# EAGLE schematic atari_superxe_motherboard (EAGLE 7.2.0)

## Sheet 1 of 12: FPGACore
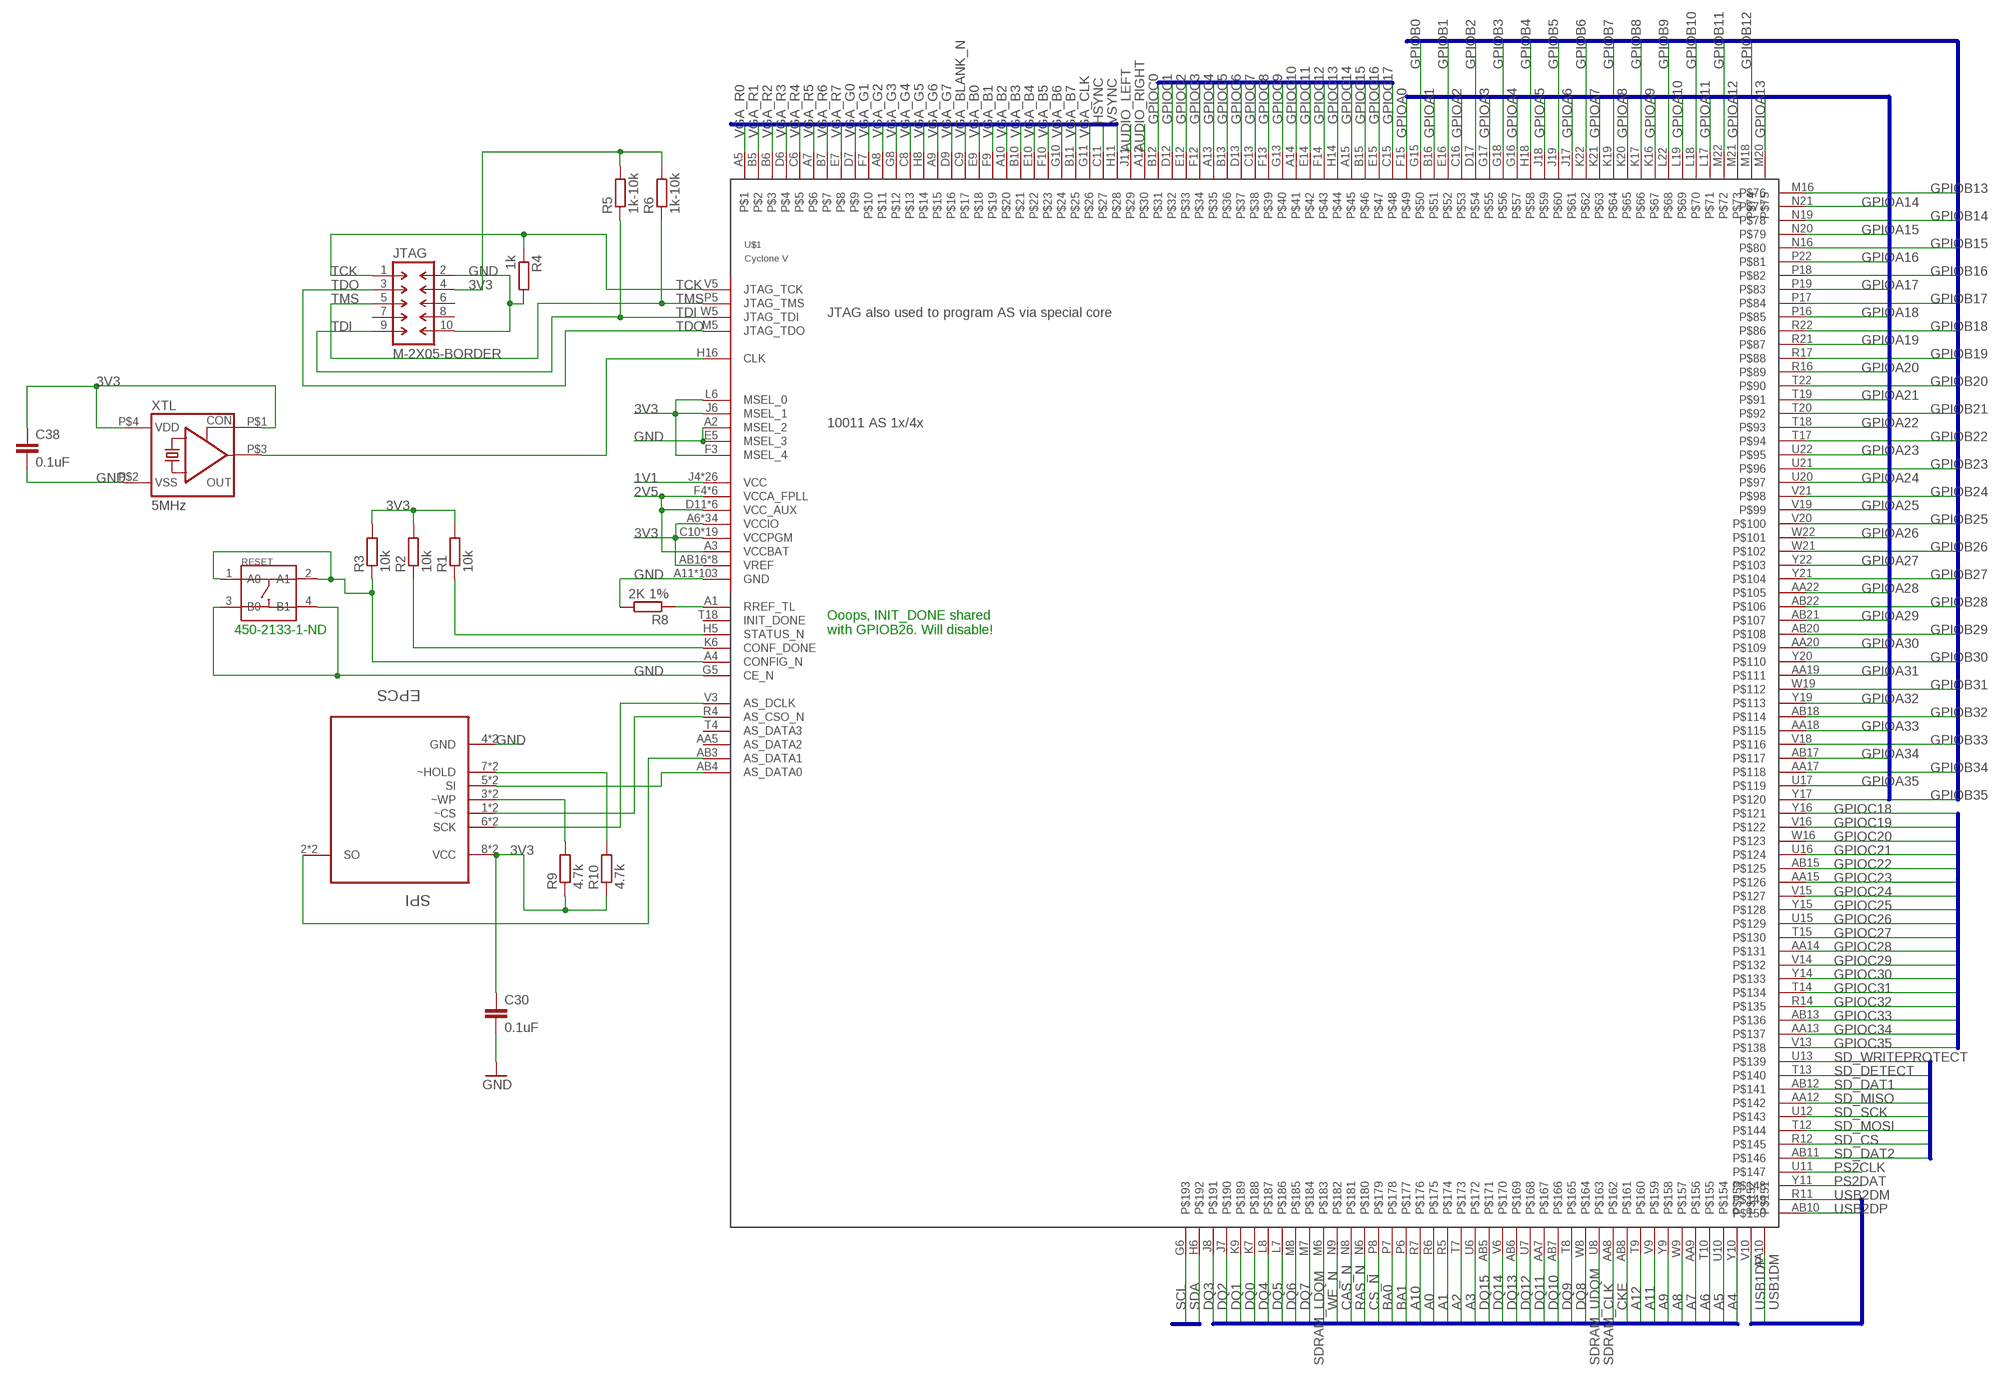
[diagram p0: schematic, sheet 1]

### Parts
C30  0.1uF  C-EUC0805  [C0805]
C38  0.1uF  C-EUC0805  [C0805]
JTAG  M-2X05-BORDER  [DIL-100-2X05-BRD]
R1  10k  R-EU_M0805  [M0805]
R2  10k  R-EU_M0805  [M0805]
R3  10k  R-EU_M0805  [M0805]
R4  1k  R-EU_M0805  [M0805]
R5  1k-10k  R-EU_M0805  [M0805]
R6  1k-10k  R-EU_M0805  [M0805]
R8  2K 1%  R-EU_M0805  [M0805]
R9  4.7k  R-EU_M0805  [M0805]
R10  4.7k  R-EU_M0805  [M0805]
RESET  SMD-BUTTON(4P-4.0X4.0X1.7MM)-DHT-1152  [SW4-SMD-4.0X4.0X1.7MM]
SPI  EPCS  EPCSBOTH  [EPCS_BOTH]
U$1  CYCLONEVFPGA484SMALLPINS  [CYCLONEVF484V2]
XTL  5MHz  CRYSTAL_RES-SG636  [SG-636]

### Nets
1V1: U$1.J4(VCC) U$1.J10(VCC) U$1.J12(VCC) U$1.J14(VCC) U$1.J16(VCC) U$1.K3(VCC) U$1.K5(VCC) U$1.K11(VCC) U$1.K13(VCC) U$1.K15(VCC) U$1.L4(VCC) U$1.L10(VCC) U$1.L12(VCC) U$1.L14(VCC) U$1.L16(VCC) U$1.M11(VCC) U$1.M13(VCC) U$1.M15(VCC) U$1.N4(VCC) U$1.N10(VCC) U$1.N12(VCC) U$1.N14(VCC) U$1.P3(VCC) U$1.P11(VCC) U$1.P13(VCC) U$1.P15(VCC) ; also sheet 2,9
2V5: U$1.A3(VCCBAT) U$1.D11(VCC_AUX) U$1.D18(VCC_AUX) U$1.E6(VCC_AUX) U$1.F4(VCCA_FPLL) U$1.H19(VCCA_FPLL) U$1.M3(VCCA_FPLL) U$1.T3(VCCA_FPLL) U$1.T5(VCCA_FPLL) U$1.U18(VCCA_FPLL) U$1.W7(VCC_AUX) U$1.W13(VCC_AUX) U$1.W18(VCC_AUX) ; also sheet 2,9
3V3: C30.1 C38.1 JTAG.4 R1.2 R2.2 R3.2 R5.2 R6.2 R9.1 R10.1 SPI.8(VCC) SPI.L$2(VCC) U$1.A6(VCCIO) U$1.A16(VCCIO) U$1.AA16(VCCIO) U$1.AA21(VCCIO) U$1.AB16(VREF) U$1.B8(VREF) U$1.B19(VCCIO) U$1.C7(VCCIO) U$1.C10(VCCPGM) U$1.C12(VCCIO) U$1.C14(VREF) U$1.C22(VCCIO) U$1.D4(VCCIO) U$1.D8(VCCPGM) U$1.D14(VCCPGM) U$1.D15(VCCIO) U$1.D16(VCCPGM) U$1.E1(VCCPGM) U$1.E8(VCCIO) U$1.E11(VCCPGM) U$1.E18(VCCIO) U$1.F3(MSEL_4) U$1.F8(VCCPGM) U$1.F11(VCCIO) U$1.F21(VCCIO) U$1.G7(VCCIO) U$1.G14(VCCIO) U$1.H17(VCCIO) U$1.J1(VCCIO) U$1.J2(VCCPGM) U$1.J6(MSEL_1) U$1.K18(VCCIO) U$1.L6(MSEL_0) U$1.L20(VREF) U$1.M17(VCCPGM) U$1.M19(VCCIO) U$1.N18(VCCPGM) U$1.P20(VCCIO) U$1.P21(VCCPGM) U$1.R1(VCCIO) U$1.R2(VCCPGM) U$1.R8(VCCIO) U$1.R18(VCCIO) U$1.R19(VCCPGM) U$1.R20(VREF) U$1.T6(VCCIO) U$1.T11(VCCIO) U$1.U14(VCCIO) U$1.U19(VCCIO) U$1.V8(VCCPGM) U$1.W1(VREF) U$1.W6(VCCPGM) U$1.W10(VCCIO) U$1.W11(VCCPGM) U$1.W12(VCCPGM) U$1.W14(VCCPGM) U$1.W15(VCCIO) U$1.W17(VCCPGM) U$1.W20(VCCIO) U$1.Y4(VCCIO) U$1.Y7(VREF) U$1.Y8(VCCIO) U$1.Y12(VREF) U$1.Y13(VCCIO) XTL.P$1(CON) XTL.P$4(VDD) ; also sheet 2,3,5,6,8,9,10,11
A0: U$1.R6 ; also sheet 6
A1: U$1.R5 ; also sheet 6
A2: U$1.T7 ; also sheet 6
A3: U$1.U6 ; also sheet 6
A4: U$1.Y10 ; also sheet 6
A5: U$1.U10 ; also sheet 6
A6: U$1.T10 ; also sheet 6
A7: U$1.AA9 ; also sheet 6
A8: U$1.W9 ; also sheet 6
A9: U$1.Y9 ; also sheet 6
A10: U$1.R7 ; also sheet 6
A11: U$1.V9 ; also sheet 6
A12: U$1.T9 ; also sheet 6
AUDIO_LEFT: U$1.J11 ; also sheet 4
AUDIO_RIGHT: U$1.A12 ; also sheet 4
BA0: U$1.P7 ; also sheet 6
BA1: U$1.P6 ; also sheet 6
CAS_N: U$1.N8 ; also sheet 6
CKE: U$1.AB8 ; also sheet 6
CONF_DONE: R2.1 U$1.K6(CONF_DONE)
CONFIG_N: R3.1 RESET.1(A0) RESET.2(A1) U$1.A4(CONFIG_N)
CS_N: U$1.P8 ; also sheet 6
DQ0: U$1.K7 ; also sheet 6
DQ1: U$1.K9 ; also sheet 6
DQ2: U$1.J7 ; also sheet 6
DQ3: U$1.J8 ; also sheet 6
DQ4: U$1.L8 ; also sheet 6
DQ5: U$1.L7 ; also sheet 6
DQ6: U$1.M8 ; also sheet 6
DQ7: U$1.M7 ; also sheet 6
DQ8: U$1.W8 ; also sheet 6
DQ9: U$1.T8 ; also sheet 6
DQ10: U$1.AB7 ; also sheet 6
DQ11: U$1.AA7 ; also sheet 6
DQ12: U$1.U7 ; also sheet 6
DQ13: U$1.AB6 ; also sheet 6
DQ14: U$1.V6 ; also sheet 6
DQ15: U$1.AB5 ; also sheet 6
GND: C30.2 C38.2 JTAG.2 JTAG.10 R4.2 R8.2 RESET.3(B0) RESET.4(B1) SPI.4(GND) SPI.L$10(GND) U$1.A2(MSEL_2) U$1.A11(GND) U$1.A21(GND) U$1.AA3(GND) U$1.AA4(GND) U$1.AA6(GND) U$1.AA11(GND) U$1.AB1(GND) U$1.AB2(GND) U$1.AB9(GND) U$1.AB14(GND) U$1.AB19(GND) U$1.B1(GND) U$1.B2(GND) U$1.B9(GND) U$1.B14(GND) U$1.C3(GND) U$1.C4(GND) U$1.C5(GND) U$1.C17(GND) U$1.D1(GND) U$1.D2(GND) U$1.D5(GND) U$1.D10(GND) U$1.D20(GND) U$1.E3(GND) U$1.E4(GND) U$1.E5(MSEL_3) U$1.E13(GND) U$1.F1(GND) U$1.F2(GND) U$1.F5(GND) U$1.F6(GND) U$1.F16(GND) U$1.F17(GND) U$1.G3(GND) U$1.G4(GND) U$1.G5(CE_N) U$1.G9(GND) U$1.G19(GND) U$1.H1(GND) U$1.H2(GND) U$1.H3(GND) U$1.H4(GND) U$1.H7(GND) U$1.H12(GND) U$1.H15(GND) U$1.H22(GND) U$1.J3(GND) U$1.J5(GND) U$1.J15(GND) U$1.J20(GND) U$1.K1(GND) U$1.K2(GND) U$1.K4(GND) U$1.K8(GND) U$1.K10(GND) U$1.K12(GND) U$1.K14(GND) U$1.L3(GND) U$1.L5(GND) U$1.L11(GND) U$1.L13(GND) U$1.L15(GND) U$1.L21(GND) U$1.M1(GND) U$1.M2(GND) U$1.M4(GND) U$1.M10(GND) U$1.M12(GND) U$1.M14(GND) U$1.N3(GND) U$1.N5(GND) U$1.N7(GND) U$1.N11(GND) U$1.N13(GND) U$1.N15(GND) U$1.N17(GND) U$1.N22(GND) U$1.P1(GND) U$1.P2(GND) U$1.P4(GND) U$1.P10(GND) U$1.R3(GND) U$1.R13(GND) U$1.T1(GND) U$1.T2(GND) U$1.T16(GND) U$1.T21(GND) U$1.U3(GND) U$1.U4(GND) U$1.U5(GND) U$1.U9(GND) U$1.V1(GND) U$1.V2(GND) U$1.V4(GND) U$1.V7(GND) U$1.V12(GND) U$1.V17(GND) U$1.V22(GND) U$1.W3(GND) U$1.W4(GND) U$1.Y1(GND) U$1.Y2(GND) U$1.Y5(GND) U$1.Y18(GND) XTL.P$2(VSS) ; also sheet 2,3,4,5,6,7,8,9,10,11,12
GPIOA0: U$1.F15 ; also sheet 5
GPIOA1: U$1.B16 ; also sheet 5
GPIOA2: U$1.C16 ; also sheet 5
GPIOA3: U$1.G17 ; also sheet 5
GPIOA4: U$1.G16 ; also sheet 5
GPIOA5: U$1.J18 ; also sheet 5
GPIOA6: U$1.J17 ; also sheet 5
GPIOA7: U$1.K21 ; also sheet 5
GPIOA8: U$1.K20 ; also sheet 5
GPIOA9: U$1.K16 ; also sheet 5
GPIOA10: U$1.L19 ; also sheet 5
GPIOA11: U$1.L17 ; also sheet 5
GPIOA12: U$1.M21 ; also sheet 5
GPIOA13: U$1.M20 ; also sheet 5
GPIOA14: U$1.N21 ; also sheet 5
GPIOA15: U$1.N20 ; also sheet 5
GPIOA16: U$1.P22 ; also sheet 5
GPIOA17: U$1.P19 ; also sheet 5
GPIOA18: U$1.P16 ; also sheet 5
GPIOA19: U$1.R21 ; also sheet 5
GPIOA20: U$1.R16 ; also sheet 5
GPIOA21: U$1.T19 ; also sheet 5
GPIOA22: U$1.T18 ; also sheet 5
GPIOA23: U$1.U22 ; also sheet 5
GPIOA24: U$1.U20 ; also sheet 5
GPIOA25: U$1.V19 ; also sheet 5
GPIOA26: U$1.W22 ; also sheet 5
GPIOA27: U$1.Y22 ; also sheet 5
GPIOA28: U$1.AA22 ; also sheet 5
GPIOA29: U$1.AB21 ; also sheet 5
GPIOA30: U$1.AA20 ; also sheet 5
GPIOA31: U$1.AA19 ; also sheet 5
GPIOA32: U$1.Y19 ; also sheet 5
GPIOA33: U$1.AA18 ; also sheet 5
GPIOA34: U$1.AB17 ; also sheet 5
GPIOA35: U$1.U17 ; also sheet 5
GPIOB0: U$1.G15 ; also sheet 5
GPIOB1: U$1.E16 ; also sheet 5
GPIOB2: U$1.D17 ; also sheet 5
GPIOB3: U$1.G18 ; also sheet 5
GPIOB4: U$1.H18 ; also sheet 5
GPIOB5: U$1.J19 ; also sheet 5
GPIOB6: U$1.K22 ; also sheet 5
GPIOB7: U$1.K19 ; also sheet 5
GPIOB8: U$1.K17 ; also sheet 5
GPIOB9: U$1.L22 ; also sheet 5
GPIOB10: U$1.L18 ; also sheet 5
GPIOB11: U$1.M22 ; also sheet 5
GPIOB12: U$1.M18 ; also sheet 5
GPIOB13: U$1.M16 ; also sheet 5
GPIOB14: U$1.N19 ; also sheet 5
GPIOB15: U$1.N16 ; also sheet 5
GPIOB16: U$1.P18 ; also sheet 5
GPIOB17: U$1.P17 ; also sheet 5
GPIOB18: U$1.R22 ; also sheet 5
GPIOB19: U$1.R17 ; also sheet 5
GPIOB20: U$1.T22 ; also sheet 5
GPIOB21: U$1.T20 ; also sheet 5
GPIOB22: U$1.T17 ; also sheet 5
GPIOB23: U$1.U21 ; also sheet 5
GPIOB24: U$1.V21 ; also sheet 5
GPIOB25: U$1.V20 ; also sheet 5
GPIOB26: U$1.W21 ; also sheet 5
GPIOB27: U$1.Y21 ; also sheet 5
GPIOB28: U$1.AB22 ; also sheet 5
GPIOB29: U$1.AB20 ; also sheet 5
GPIOB30: U$1.Y20 ; also sheet 5
GPIOB31: U$1.W19 ; also sheet 5
GPIOB32: U$1.AB18 ; also sheet 5
GPIOB33: U$1.V18 ; also sheet 5
GPIOB34: U$1.AA17 ; also sheet 5
GPIOB35: U$1.Y17 ; also sheet 5
GPIOC0: U$1.B12 ; also sheet 5
GPIOC1: U$1.D12 ; also sheet 5
GPIOC2: U$1.E12 ; also sheet 5
GPIOC3: U$1.F12 ; also sheet 5
GPIOC4: U$1.A13 ; also sheet 5
GPIOC5: U$1.B13 ; also sheet 5
GPIOC6: U$1.D13 ; also sheet 5
GPIOC7: U$1.C13 ; also sheet 5
GPIOC8: U$1.F13 ; also sheet 5
GPIOC9: U$1.G13 ; also sheet 5
GPIOC10: U$1.A14 ; also sheet 5
GPIOC11: U$1.E14 ; also sheet 5
GPIOC12: U$1.F14 ; also sheet 5
GPIOC13: U$1.H14 ; also sheet 5
GPIOC14: U$1.A15 ; also sheet 5
GPIOC15: U$1.B15 ; also sheet 5
GPIOC16: U$1.E15 ; also sheet 5
GPIOC17: U$1.C15 ; also sheet 5
GPIOC18: U$1.Y16 ; also sheet 5
GPIOC19: U$1.V16 ; also sheet 5
GPIOC20: U$1.W16 ; also sheet 5
GPIOC21: U$1.U16 ; also sheet 5
GPIOC22: U$1.AB15 ; also sheet 5
GPIOC23: U$1.AA15 ; also sheet 5
GPIOC24: U$1.V15 ; also sheet 5
GPIOC25: U$1.Y15 ; also sheet 5
GPIOC26: U$1.U15 ; also sheet 5
GPIOC27: U$1.T15 ; also sheet 5
GPIOC28: U$1.AA14 ; also sheet 5
GPIOC29: U$1.V14 ; also sheet 5
GPIOC30: U$1.Y14 ; also sheet 5
GPIOC31: U$1.T14 ; also sheet 5
GPIOC32: U$1.R14 ; also sheet 5
GPIOC33: U$1.AB13 ; also sheet 5
GPIOC34: U$1.AA13 ; also sheet 5
GPIOC35: U$1.V13 ; also sheet 5
HSYNC: U$1.C11 ; also sheet 3
N$6: SPI.6(SCK) SPI.L$16(SCK) U$1.V3(AS_DCLK)
N$7: SPI.1(~CS) SPI.L$7(~CS) U$1.R4(AS_CSO_N)
N$8: SPI.2(SO) SPI.L$8(SO) U$1.AB3(AS_DATA1)
N$9: SPI.5(SI) SPI.L$15(SI) U$1.AB4(AS_DATA0)
N$10: R9.2 SPI.3(~WP) SPI.L$9(~WP)
N$11: R10.2 SPI.7(~HOLD) SPI.L$1(~HOLD)
N$12: U$1.H16(CLK) XTL.P$3(OUT)
PS2CLK: U$1.U11 ; also sheet 7
PS2DAT: U$1.Y11 ; also sheet 7
RAS_N: U$1.N6 ; also sheet 6
RREF_TL: R8.1 U$1.A1(RREF_TL)
SCL: U$1.G6 ; also sheet 11
SD_CS: U$1.R12 ; also sheet 10
SD_DAT1: U$1.AB12 ; also sheet 10
SD_DAT2: U$1.AB11 ; also sheet 10
SD_DETECT: U$1.T13 ; also sheet 10
SD_MISO: U$1.AA12 ; also sheet 10
SD_MOSI: U$1.T12 ; also sheet 10
SD_SCK: U$1.U12 ; also sheet 10
SD_WRITEPROTECT: U$1.U13 ; also sheet 10
SDA: U$1.H6 ; also sheet 11
SDRAM_CLK: U$1.AA8 ; also sheet 6
SDRAM_LDQM: U$1.M6 ; also sheet 6
SDRAM_UDQM: U$1.U8 ; also sheet 6
STATUS_N: R1.1 U$1.H5(STATUS_N)
TCK: JTAG.1 R4.1 U$1.V5(JTAG_TCK)
TDI: JTAG.9 R5.1 U$1.W5(JTAG_TDI)
TDO: JTAG.3 U$1.M5(JTAG_TDO)
TMS: JTAG.5 R6.1 U$1.P5(JTAG_TMS)
USB1DM: U$1.AA10 ; also sheet 7
USB1DP: U$1.V10 ; also sheet 7
USB2DM: U$1.R11 ; also sheet 7
USB2DP: U$1.AB10 ; also sheet 7
VGA_B0: U$1.E9 ; also sheet 3
VGA_B1: U$1.F9 ; also sheet 3
VGA_B2: U$1.A10 ; also sheet 3
VGA_B3: U$1.B10 ; also sheet 3
VGA_B4: U$1.E10 ; also sheet 3
VGA_B5: U$1.F10 ; also sheet 3
VGA_B6: U$1.G10 ; also sheet 3
VGA_B7: U$1.B11 ; also sheet 3
VGA_BLANK_N: U$1.C9 ; also sheet 3
VGA_CLK: U$1.G11 ; also sheet 3
VGA_G0: U$1.D7 ; also sheet 3
VGA_G1: U$1.F7 ; also sheet 3
VGA_G2: U$1.A8 ; also sheet 3
VGA_G3: U$1.G8 ; also sheet 3
VGA_G4: U$1.C8 ; also sheet 3
VGA_G5: U$1.H8 ; also sheet 3
VGA_G6: U$1.A9 ; also sheet 3
VGA_G7: U$1.D9 ; also sheet 3
VGA_R0: U$1.A5 ; also sheet 3
VGA_R1: U$1.B5 ; also sheet 3
VGA_R2: U$1.B6 ; also sheet 3
VGA_R3: U$1.D6 ; also sheet 3
VGA_R4: U$1.C6 ; also sheet 3
VGA_R5: U$1.A7 ; also sheet 3
VGA_R6: U$1.B7 ; also sheet 3
VGA_R7: U$1.E7 ; also sheet 3
VSYNC: U$1.H11 ; also sheet 3
WE_N: U$1.N9 ; also sheet 6
Unconnected: JTAG.6 JTAG.7 JTAG.8 U$1.AA5(AS_DATA2) U$1.T4(AS_DATA3) U$1.T18(INIT_DONE)

### Buses
SDRAM:A[0..12],DQ[0..15],CS_N,RAS_N,CAS_N,WE_N,SDRAM_CLK,CKE,SDRAM_UDQM,SDRAM_LDQM,BA[0..1]
USB1DP,USB1DM,USB2DP,USB2DM
VGADAC:VGA_R[0..7],VGA_G[0..7],VGA_B[0..7],VGA_CLK,VGA_BLANK_N,HSYNC,VSYNC
SD_DETECT,SD_WRITEPROTECT,SD_CS,SD_MISO,SD_MOSI,SD_SCK,SD_DAT1,SD_DAT2
GPIOC[0..35]
GPIOA[0..35]
GPIOB[0..35]
ADC:SCL,SDA

### Notes on the sheet
- JTAG also used to program AS via special core
- 10011 AS 1x/4x
- 450-2133-1-ND
- Ooops, INIT_DONE shared
  with GPIOB26. Will disable!

## Sheet 2 of 12: FPGA decoupling
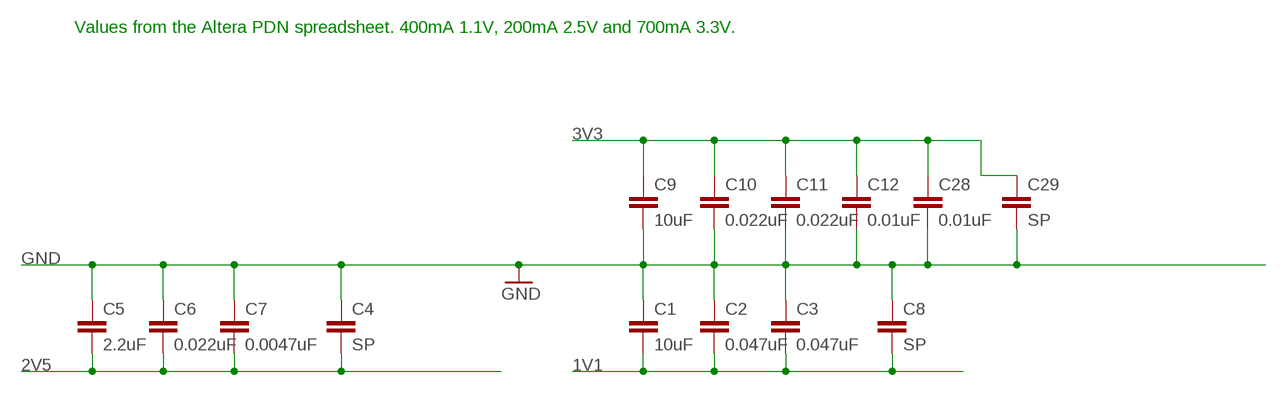
[diagram p1: schematic, sheet 2]

### Parts
C1  10uF  C-EUC0805  [C0805]
C2  0.047uF  C-EUC0805  [C0805]
C3  0.047uF  C-EUC0805  [C0805]
C4  SP  C-EUC0805  [C0805]
C5  2.2uF  C-EUC0805  [C0805]
C6  0.022uF  C-EUC0805  [C0805]
C7  0.0047uF  C-EUC0805  [C0805]
C8  SP  C-EUC0805  [C0805]
C9  10uF  C-EUC0805  [C0805]
C10  0.022uF  C-EUC0805  [C0805]
C11  0.022uF  C-EUC0805  [C0805]
C12  0.01uF  C-EUC0805  [C0805]
C28  0.01uF  C-EUC0805  [C0805]
C29  SP  C-EUC0805  [C0805]

### Nets
1V1: C1.2 C2.2 C3.2 C8.2 ; also sheet 1,9
2V5: C4.2 C5.2 C6.2 C7.2 ; also sheet 1,9
3V3: C9.1 C10.1 C11.1 C12.1 C28.1 C29.1 ; also sheet 1,3,5,6,8,9,10,11
GND: C1.1 C2.1 C3.1 C4.1 C5.1 C6.1 C7.1 C8.1 C9.2 C10.2 C11.2 C12.2 C28.2 C29.2 ; also sheet 1,3,4,5,6,7,8,9,10,11,12

### Notes on the sheet
- Values from the Altera PDN spreadsheet. 400mA 1.1V, 200mA 2.5V and 700mA 3.3V.

## Sheet 3 of 12: Video
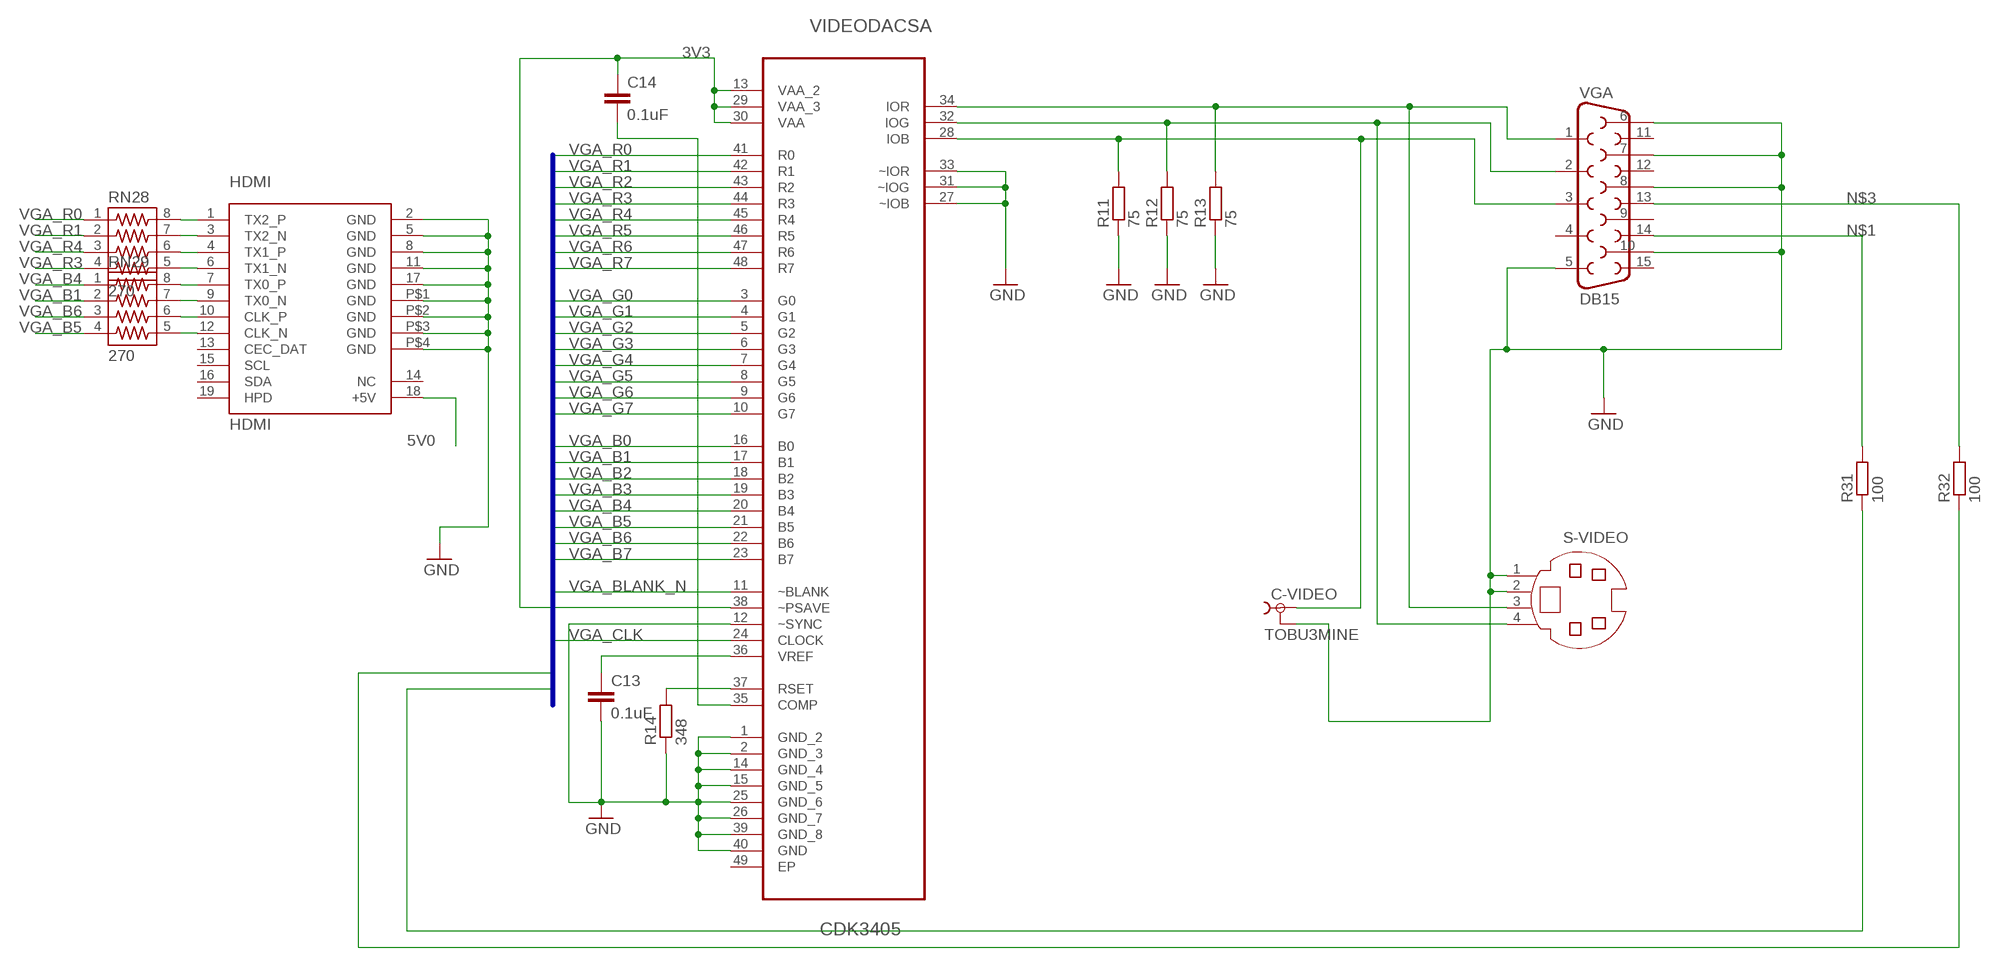
[diagram p2: schematic, sheet 3]

### Parts
C13  0.1uF  C-EUC0805  [C0805]
C14  0.1uF  C-EUC0805  [C0805]
C-VIDEO  TOBU3MINE  [TOBU3_EXT]
HDMI  HDMI  [HDMI]
R11  75  R-EU_M0805  [M0805]
R12  75  R-EU_M0805  [M0805]
R13  75  R-EU_M0805  [M0805]
R14  348  R-EU_M0805  [M0805]
R31  100  R-EU_R0805  [R0805]
R32  100  R-EU_R0805  [R0805]
RN28  270  742-8742_3  [743-8]
RN29  270  742-8742_3  [743-8]
S-VIDEO  MD04SS  [MDIN04SS]
VGA  DB15  [DB15]
VIDEODACSA  CDK3405  ADV7125BCPZ170TQFP-48  [QFP50P900X900X120-49N]

### Nets
3V3: C14.1 VIDEODACSA.13(VAA_2) VIDEODACSA.29(VAA_3) VIDEODACSA.30(VAA) VIDEODACSA.38(~PSAVE) ; also sheet 1,2,5,6,8,9,10,11
5V0: HDMI.18(+5V) ; also sheet 5,7,9,11
GND: C13.2 C-VIDEO.2 C-VIDEO.2@1 C-VIDEO.2@2 HDMI.2(GND) HDMI.5(GND) HDMI.8(GND) HDMI.11(GND) HDMI.17(GND) HDMI.P$1(GND) HDMI.P$2(GND) HDMI.P$3(GND) HDMI.P$4(GND) R11.1 R12.1 R13.1 R14.1 S-VIDEO.1 S-VIDEO.2 VGA.5 VGA.6 VGA.7 VGA.8 VGA.10 VIDEODACSA.1(GND_2) VIDEODACSA.2(GND_3) VIDEODACSA.12(~SYNC) VIDEODACSA.14(GND_4) VIDEODACSA.15(GND_5) VIDEODACSA.25(GND_6) VIDEODACSA.26(GND_7) VIDEODACSA.27(~IOB) VIDEODACSA.31(~IOG) VIDEODACSA.33(~IOR) VIDEODACSA.39(GND_8) VIDEODACSA.40(GND) ; also sheet 1,2,4,5,6,7,8,9,10,11,12
HSYNC: R32.1 ; also sheet 1
N$1: R31.2 VGA.14
N$3: R32.2 VGA.13
N$13: R13.2 S-VIDEO.3 VGA.1 VIDEODACSA.34(IOR)
N$14: R12.2 S-VIDEO.4 VGA.2 VIDEODACSA.32(IOG)
N$16: C13.1 VIDEODACSA.36(VREF)
N$17: R14.2 VIDEODACSA.37(RSET)
N$18: C14.2 VIDEODACSA.35(COMP)
N$134: HDMI.1(TX2_P) RN28.8
N$143: C-VIDEO.1 R11.2 VGA.3 VIDEODACSA.28(IOB)
N$144: HDMI.3(TX2_N) RN28.7
N$146: HDMI.4(TX1_P) RN28.6
N$147: HDMI.6(TX1_N) RN28.5
N$148: HDMI.7(TX0_P) RN29.8
N$149: HDMI.9(TX0_N) RN29.7
N$150: HDMI.10(CLK_P) RN29.6
N$151: HDMI.12(CLK_N) RN29.5
VGA_B0: VIDEODACSA.16(B0) ; also sheet 1
VGA_B1: RN29.2 VIDEODACSA.17(B1) ; also sheet 1
VGA_B2: VIDEODACSA.18(B2) ; also sheet 1
VGA_B3: VIDEODACSA.19(B3) ; also sheet 1
VGA_B4: RN29.1 VIDEODACSA.20(B4) ; also sheet 1
VGA_B5: RN29.4 VIDEODACSA.21(B5) ; also sheet 1
VGA_B6: RN29.3 VIDEODACSA.22(B6) ; also sheet 1
VGA_B7: VIDEODACSA.23(B7) ; also sheet 1
VGA_BLANK_N: VIDEODACSA.11(~BLANK) ; also sheet 1
VGA_CLK: VIDEODACSA.24(CLOCK) ; also sheet 1
VGA_G0: VIDEODACSA.3(G0) ; also sheet 1
VGA_G1: VIDEODACSA.4(G1) ; also sheet 1
VGA_G2: VIDEODACSA.5(G2) ; also sheet 1
VGA_G3: VIDEODACSA.6(G3) ; also sheet 1
VGA_G4: VIDEODACSA.7(G4) ; also sheet 1
VGA_G5: VIDEODACSA.8(G5) ; also sheet 1
VGA_G6: VIDEODACSA.9(G6) ; also sheet 1
VGA_G7: VIDEODACSA.10(G7) ; also sheet 1
VGA_R0: RN28.1 VIDEODACSA.41(R0) ; also sheet 1
VGA_R1: RN28.2 VIDEODACSA.42(R1) ; also sheet 1
VGA_R2: VIDEODACSA.43(R2) ; also sheet 1
VGA_R3: RN28.4 VIDEODACSA.44(R3) ; also sheet 1
VGA_R4: RN28.3 VIDEODACSA.45(R4) ; also sheet 1
VGA_R5: VIDEODACSA.46(R5) ; also sheet 1
VGA_R6: VIDEODACSA.47(R6) ; also sheet 1
VGA_R7: VIDEODACSA.48(R7) ; also sheet 1
VSYNC: R31.1 ; also sheet 1
Unconnected: HDMI.13(CEC_DAT) HDMI.14(NC) HDMI.15(SCL) HDMI.16(SDA) HDMI.19(HPD) VGA.4 VGA.9 VGA.11 VGA.12 VGA.15 VIDEODACSA.49(EP)

### Buses
VGADAC:VGA_R[0..7],VGA_G[0..7],VGA_B[0..7],VGA_CLK,VGA_BLANK_N,HSYNC,VSYNC

## Sheet 4 of 12: Audio
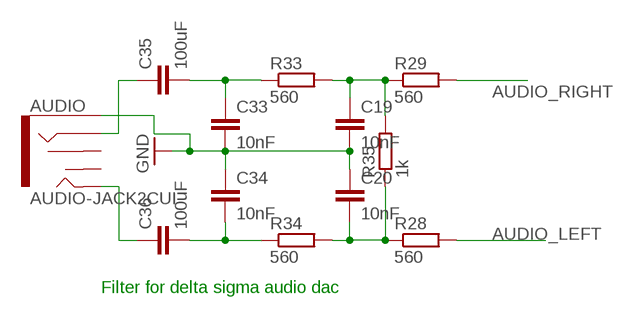
[diagram p3: schematic, sheet 4]

### Parts
AUDIO  AUDIO-JACK2CUI  [AUDIO-JACK-CUI-353X]
C19  10nF  C-EUC0805  [C0805]
C20  10nF  C-EUC0805  [C0805]
C33  10nF  C-EUC0805  [C0805]
C34  10nF  C-EUC0805  [C0805]
C35  100uF  C-EUC1206  [C1206]
C36  100uF  C-EUC1206  [C1206]
R28  560  R-EU_M0805  [M0805]
R29  560  R-EU_M0805  [M0805]
R33  560  R-EU_M0805  [M0805]
R34  560  R-EU_M0805  [M0805]
R35  1k  R-EU_M0805  [M0805]

### Nets
AUDIO_LEFT: R28.2 ; also sheet 1
AUDIO_RIGHT: R29.2 ; also sheet 1
GND: AUDIO.P$1(SLEEVE) C19.2 C20.1 C33.2 C34.1 ; also sheet 1,2,3,5,6,7,8,9,10,11,12
N$5: C33.1 C35.2 R33.1
N$27: C19.1 R29.1 R33.2 R35.2
N$28: C20.2 R28.1 R34.2 R35.1
N$138: AUDIO.P$3(RING) C35.1
N$141: AUDIO.P$2(TIP) C36.1
N$142: C34.2 C36.2 R34.1
Unconnected: AUDIO.P$4(TSH) AUDIO.P$5(RSH)

### Notes on the sheet
- Filter for delta sigma audio dac

## Sheet 5 of 12: GPIO
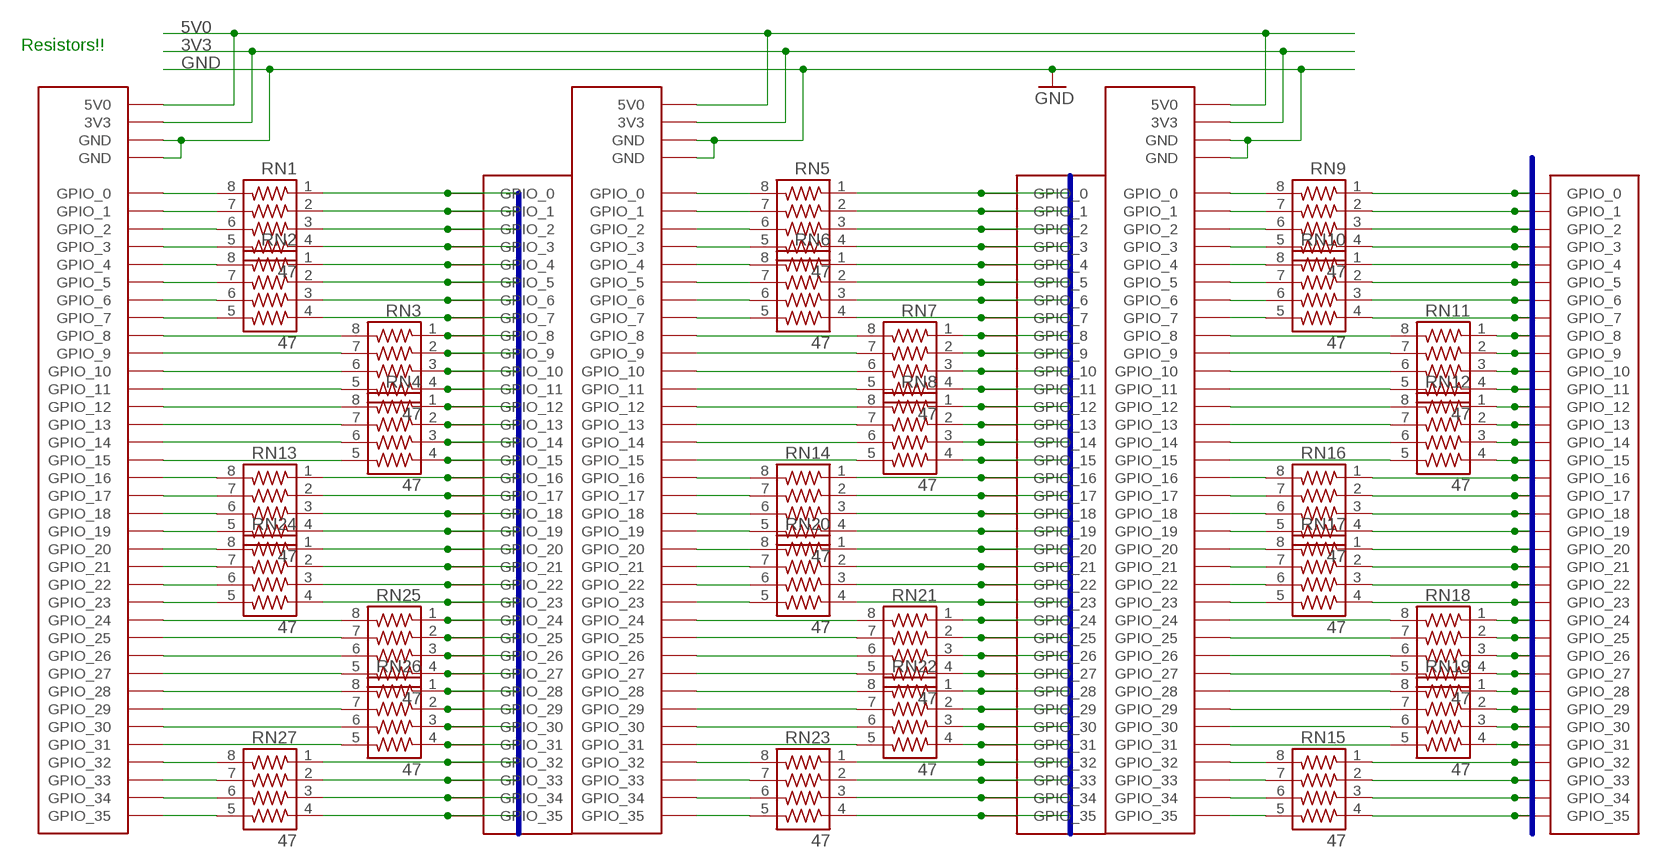
[diagram p4: schematic, sheet 5]

### Parts
GPIO_A  DE1_GPIO  [DIL-100-2X20]
GPIO_B  DE1_GPIO  [DIL-100-2X20]
GPIO_C  DE1_GPIO  [DIL-100-2X20]
RN1  47  742-8742_3  [743-8]
RN2  47  742-8742_3  [743-8]
RN3  47  742-8742_3  [743-8]
RN4  47  742-8742_3  [743-8]
RN5  47  742-8742_3  [743-8]
RN6  47  742-8742_3  [743-8]
RN7  47  742-8742_3  [743-8]
RN8  47  742-8742_3  [743-8]
RN9  47  742-8742_3  [743-8]
RN10  47  742-8742_3  [743-8]
RN11  47  742-8742_3  [743-8]
RN12  47  742-8742_3  [743-8]
RN13  47  742-8742_3  [743-8]
RN14  47  742-8742_3  [743-8]
RN15  47  742-8742_3  [743-8]
RN16  47  742-8742_3  [743-8]
RN17  47  742-8742_3  [743-8]
RN18  47  742-8742_3  [743-8]
RN19  47  742-8742_3  [743-8]
RN20  47  742-8742_3  [743-8]
RN21  47  742-8742_3  [743-8]
RN22  47  742-8742_3  [743-8]
RN23  47  742-8742_3  [743-8]
RN24  47  742-8742_3  [743-8]
RN25  47  742-8742_3  [743-8]
RN26  47  742-8742_3  [743-8]
RN27  47  742-8742_3  [743-8]
U$3  HDR_SMALL_36_DEV_LALIGNED  [HDR_141_36]
U$4  HDR_SMALL_36_DEV_LALIGNED  [HDR_141_36]
U$5  HDR_SMALL_36_DEV_LALIGNED  [HDR_141_36]

### Nets
3V3: GPIO_A.29(3V3) GPIO_B.29(3V3) GPIO_C.29(3V3) ; also sheet 1,2,3,6,8,9,10,11
5V0: GPIO_A.11(5V0) GPIO_B.11(5V0) GPIO_C.11(5V0) ; also sheet 3,7,9,11
GND: GPIO_A.12(GND) GPIO_A.30(GND) GPIO_B.12(GND) GPIO_B.30(GND) GPIO_C.12(GND) GPIO_C.30(GND) ; also sheet 1,2,3,4,6,7,8,9,10,11,12
GPIOA0: RN1.1 U$5.P$1(GPIO_0) ; also sheet 1
GPIOA1: RN1.2 U$5.P$2(GPIO_1) ; also sheet 1
GPIOA2: RN1.3 U$5.P$3(GPIO_2) ; also sheet 1
GPIOA3: RN1.4 U$5.P$4(GPIO_3) ; also sheet 1
GPIOA4: RN2.1 U$5.P$5(GPIO_4) ; also sheet 1
GPIOA5: RN2.2 U$5.P$6(GPIO_5) ; also sheet 1
GPIOA6: RN2.3 U$5.P$7(GPIO_6) ; also sheet 1
GPIOA7: RN2.4 U$5.P$8(GPIO_7) ; also sheet 1
GPIOA8: RN3.1 U$5.P$9(GPIO_8) ; also sheet 1
GPIOA9: RN3.2 U$5.P$10(GPIO_9) ; also sheet 1
GPIOA10: RN3.3 U$5.P$11(GPIO_10) ; also sheet 1
GPIOA11: RN3.4 U$5.P$12(GPIO_11) ; also sheet 1
GPIOA12: RN4.1 U$5.P$13(GPIO_12) ; also sheet 1
GPIOA13: RN4.2 U$5.P$14(GPIO_13) ; also sheet 1
GPIOA14: RN4.3 U$5.P$15(GPIO_14) ; also sheet 1
GPIOA15: RN4.4 U$5.P$16(GPIO_15) ; also sheet 1
GPIOA16: RN13.1 U$5.P$17(GPIO_16) ; also sheet 1
GPIOA17: RN13.2 U$5.P$18(GPIO_17) ; also sheet 1
GPIOA18: RN13.3 U$5.P$19(GPIO_18) ; also sheet 1
GPIOA19: RN13.4 U$5.P$20(GPIO_19) ; also sheet 1
GPIOA20: RN24.1 U$5.P$21(GPIO_20) ; also sheet 1
GPIOA21: RN24.2 U$5.P$22(GPIO_21) ; also sheet 1
GPIOA22: RN24.3 U$5.P$23(GPIO_22) ; also sheet 1
GPIOA23: RN24.4 U$5.P$24(GPIO_23) ; also sheet 1
GPIOA24: RN25.1 U$5.P$25(GPIO_24) ; also sheet 1
GPIOA25: RN25.2 U$5.P$26(GPIO_25) ; also sheet 1
GPIOA26: RN25.3 U$5.P$27(GPIO_26) ; also sheet 1
GPIOA27: RN25.4 U$5.P$28(GPIO_27) ; also sheet 1
GPIOA28: RN26.1 U$5.P$29(GPIO_28) ; also sheet 1
GPIOA29: RN26.2 U$5.P$30(GPIO_29) ; also sheet 1
GPIOA30: RN26.3 U$5.P$31(GPIO_30) ; also sheet 1
GPIOA31: RN26.4 U$5.P$32(GPIO_31) ; also sheet 1
GPIOA32: RN27.1 U$5.P$33(GPIO_32) ; also sheet 1
GPIOA33: RN27.2 U$5.P$34(GPIO_33) ; also sheet 1
GPIOA34: RN27.3 U$5.P$35(GPIO_34) ; also sheet 1
GPIOA35: RN27.4 U$5.P$36(GPIO_35) ; also sheet 1
GPIOB0: RN5.1 U$4.P$1(GPIO_0) ; also sheet 1
GPIOB1: RN5.2 U$4.P$2(GPIO_1) ; also sheet 1
GPIOB2: RN5.3 U$4.P$3(GPIO_2) ; also sheet 1
GPIOB3: RN5.4 U$4.P$4(GPIO_3) ; also sheet 1
GPIOB4: RN6.1 U$4.P$5(GPIO_4) ; also sheet 1
GPIOB5: RN6.2 U$4.P$6(GPIO_5) ; also sheet 1
GPIOB6: RN6.3 U$4.P$7(GPIO_6) ; also sheet 1
GPIOB7: RN6.4 U$4.P$8(GPIO_7) ; also sheet 1
GPIOB8: RN7.1 U$4.P$9(GPIO_8) ; also sheet 1
GPIOB9: RN7.2 U$4.P$10(GPIO_9) ; also sheet 1
GPIOB10: RN7.3 U$4.P$11(GPIO_10) ; also sheet 1
GPIOB11: RN7.4 U$4.P$12(GPIO_11) ; also sheet 1
GPIOB12: RN8.1 U$4.P$13(GPIO_12) ; also sheet 1
GPIOB13: RN8.2 U$4.P$14(GPIO_13) ; also sheet 1
GPIOB14: RN8.3 U$4.P$15(GPIO_14) ; also sheet 1
GPIOB15: RN8.4 U$4.P$16(GPIO_15) ; also sheet 1
GPIOB16: RN14.1 U$4.P$17(GPIO_16) ; also sheet 1
GPIOB17: RN14.2 U$4.P$18(GPIO_17) ; also sheet 1
GPIOB18: RN14.3 U$4.P$19(GPIO_18) ; also sheet 1
GPIOB19: RN14.4 U$4.P$20(GPIO_19) ; also sheet 1
GPIOB20: RN20.1 U$4.P$21(GPIO_20) ; also sheet 1
GPIOB21: RN20.2 U$4.P$22(GPIO_21) ; also sheet 1
GPIOB22: RN20.3 U$4.P$23(GPIO_22) ; also sheet 1
GPIOB23: RN20.4 U$4.P$24(GPIO_23) ; also sheet 1
GPIOB24: RN21.1 U$4.P$25(GPIO_24) ; also sheet 1
GPIOB25: RN21.2 U$4.P$26(GPIO_25) ; also sheet 1
GPIOB26: RN21.3 U$4.P$27(GPIO_26) ; also sheet 1
GPIOB27: RN21.4 U$4.P$28(GPIO_27) ; also sheet 1
GPIOB28: RN22.1 U$4.P$29(GPIO_28) ; also sheet 1
GPIOB29: RN22.2 U$4.P$30(GPIO_29) ; also sheet 1
GPIOB30: RN22.3 U$4.P$31(GPIO_30) ; also sheet 1
GPIOB31: RN22.4 U$4.P$32(GPIO_31) ; also sheet 1
GPIOB32: RN23.1 U$4.P$33(GPIO_32) ; also sheet 1
GPIOB33: RN23.2 U$4.P$34(GPIO_33) ; also sheet 1
GPIOB34: RN23.3 U$4.P$35(GPIO_34) ; also sheet 1
GPIOB35: RN23.4 U$4.P$36(GPIO_35) ; also sheet 1
GPIOC0: RN9.1 U$3.P$1(GPIO_0) ; also sheet 1
GPIOC1: RN9.2 U$3.P$2(GPIO_1) ; also sheet 1
GPIOC2: RN9.3 U$3.P$3(GPIO_2) ; also sheet 1
GPIOC3: RN9.4 U$3.P$4(GPIO_3) ; also sheet 1
GPIOC4: RN10.1 U$3.P$5(GPIO_4) ; also sheet 1
GPIOC5: RN10.2 U$3.P$6(GPIO_5) ; also sheet 1
GPIOC6: RN10.3 U$3.P$7(GPIO_6) ; also sheet 1
GPIOC7: RN10.4 U$3.P$8(GPIO_7) ; also sheet 1
GPIOC8: RN11.1 U$3.P$9(GPIO_8) ; also sheet 1
GPIOC9: RN11.2 U$3.P$10(GPIO_9) ; also sheet 1
GPIOC10: RN11.3 U$3.P$11(GPIO_10) ; also sheet 1
GPIOC11: RN11.4 U$3.P$12(GPIO_11) ; also sheet 1
GPIOC12: RN12.1 U$3.P$13(GPIO_12) ; also sheet 1
GPIOC13: RN12.2 U$3.P$14(GPIO_13) ; also sheet 1
GPIOC14: RN12.3 U$3.P$15(GPIO_14) ; also sheet 1
GPIOC15: RN12.4 U$3.P$16(GPIO_15) ; also sheet 1
GPIOC16: RN16.1 U$3.P$17(GPIO_16) ; also sheet 1
GPIOC17: RN16.2 U$3.P$18(GPIO_17) ; also sheet 1
GPIOC18: RN16.3 U$3.P$19(GPIO_18) ; also sheet 1
GPIOC19: RN16.4 U$3.P$20(GPIO_19) ; also sheet 1
GPIOC20: RN17.1 U$3.P$21(GPIO_20) ; also sheet 1
GPIOC21: RN17.2 U$3.P$22(GPIO_21) ; also sheet 1
GPIOC22: RN17.3 U$3.P$23(GPIO_22) ; also sheet 1
GPIOC23: RN17.4 U$3.P$24(GPIO_23) ; also sheet 1
GPIOC24: RN18.1 U$3.P$25(GPIO_24) ; also sheet 1
GPIOC25: RN18.2 U$3.P$26(GPIO_25) ; also sheet 1
GPIOC26: RN18.3 U$3.P$27(GPIO_26) ; also sheet 1
GPIOC27: RN18.4 U$3.P$28(GPIO_27) ; also sheet 1
GPIOC28: RN19.1 U$3.P$29(GPIO_28) ; also sheet 1
GPIOC29: RN19.2 U$3.P$30(GPIO_29) ; also sheet 1
GPIOC30: RN19.3 U$3.P$31(GPIO_30) ; also sheet 1
GPIOC31: RN19.4 U$3.P$32(GPIO_31) ; also sheet 1
GPIOC32: RN15.1 U$3.P$33(GPIO_32) ; also sheet 1
GPIOC33: RN15.2 U$3.P$34(GPIO_33) ; also sheet 1
GPIOC34: RN15.3 U$3.P$35(GPIO_34) ; also sheet 1
GPIOC35: RN15.4 U$3.P$36(GPIO_35) ; also sheet 1
N$15: GPIO_C.1(GPIO_0) RN9.8
N$22: GPIO_A.1(GPIO_0) RN1.8
N$24: GPIO_A.2(GPIO_1) RN1.7
N$29: GPIO_A.3(GPIO_2) RN1.6
N$30: GPIO_A.4(GPIO_3) RN1.5
N$31: GPIO_A.5(GPIO_4) RN2.8
N$32: GPIO_A.6(GPIO_5) RN2.7
N$33: GPIO_A.7(GPIO_6) RN2.6
N$34: GPIO_A.8(GPIO_7) RN2.5
N$35: GPIO_A.9(GPIO_8) RN3.8
N$36: GPIO_A.10(GPIO_9) RN3.7
N$37: GPIO_A.13(GPIO_10) RN3.6
N$38: GPIO_A.14(GPIO_11) RN3.5
N$39: GPIO_A.15(GPIO_12) RN4.8
N$40: GPIO_A.17(GPIO_14) RN4.6
N$41: GPIO_A.16(GPIO_13) RN4.7
N$42: GPIO_A.18(GPIO_15) RN4.5
N$43: GPIO_A.19(GPIO_16) RN13.8
N$44: GPIO_A.20(GPIO_17) RN13.7
N$45: GPIO_A.21(GPIO_18) RN13.6
N$46: GPIO_A.22(GPIO_19) RN13.5
N$47: GPIO_A.23(GPIO_20) RN24.8
N$48: GPIO_A.25(GPIO_22) RN24.6
N$49: GPIO_A.24(GPIO_21) RN24.7
N$50: GPIO_A.26(GPIO_23) RN24.5
N$51: GPIO_A.27(GPIO_24) RN25.8
N$52: GPIO_A.28(GPIO_25) RN25.7
N$53: GPIO_A.31(GPIO_26) RN25.6
N$54: GPIO_A.32(GPIO_27) RN25.5
N$55: GPIO_A.33(GPIO_28) RN26.8
N$56: GPIO_A.34(GPIO_29) RN26.7
N$57: GPIO_A.35(GPIO_30) RN26.6
N$58: GPIO_A.36(GPIO_31) RN26.5
N$59: GPIO_A.37(GPIO_32) RN27.8
N$60: GPIO_A.38(GPIO_33) RN27.7
N$61: GPIO_A.39(GPIO_34) RN27.6
N$62: GPIO_A.40(GPIO_35) RN27.5
N$63: GPIO_B.1(GPIO_0) RN5.8
N$64: GPIO_B.2(GPIO_1) RN5.7
N$65: GPIO_B.3(GPIO_2) RN5.6
N$66: GPIO_B.4(GPIO_3) RN5.5
N$67: GPIO_B.5(GPIO_4) RN6.8
N$68: GPIO_B.6(GPIO_5) RN6.7
N$69: GPIO_B.7(GPIO_6) RN6.6
N$70: GPIO_B.8(GPIO_7) RN6.5
N$71: GPIO_B.9(GPIO_8) RN7.8
N$72: GPIO_B.10(GPIO_9) RN7.7
N$73: GPIO_B.13(GPIO_10) RN7.6
N$74: GPIO_B.14(GPIO_11) RN7.5
N$75: GPIO_B.15(GPIO_12) RN8.8
N$76: GPIO_B.16(GPIO_13) RN8.7
N$77: GPIO_B.17(GPIO_14) RN8.6
N$78: GPIO_B.18(GPIO_15) RN8.5
N$79: GPIO_B.19(GPIO_16) RN14.8
N$80: GPIO_B.20(GPIO_17) RN14.7
N$81: GPIO_B.21(GPIO_18) RN14.6
N$82: GPIO_B.22(GPIO_19) RN14.5
N$83: GPIO_B.23(GPIO_20) RN20.8
N$84: GPIO_B.24(GPIO_21) RN20.7
N$85: GPIO_B.25(GPIO_22) RN20.6
N$86: GPIO_B.26(GPIO_23) RN20.5
N$87: GPIO_B.27(GPIO_24) RN21.8
N$88: GPIO_B.28(GPIO_25) RN21.7
N$89: GPIO_B.31(GPIO_26) RN21.6
N$90: GPIO_B.32(GPIO_27) RN21.5
N$91: GPIO_B.33(GPIO_28) RN22.8
N$92: GPIO_B.34(GPIO_29) RN22.7
N$93: GPIO_B.35(GPIO_30) RN22.6
N$94: GPIO_B.36(GPIO_31) RN22.5
N$95: GPIO_B.37(GPIO_32) RN23.8
N$96: GPIO_B.38(GPIO_33) RN23.7
N$97: GPIO_B.39(GPIO_34) RN23.6
N$98: GPIO_B.40(GPIO_35) RN23.5
N$99: GPIO_C.2(GPIO_1) RN9.7
N$100: GPIO_C.3(GPIO_2) RN9.6
N$101: GPIO_C.4(GPIO_3) RN9.5
N$102: GPIO_C.5(GPIO_4) RN10.8
N$103: GPIO_C.6(GPIO_5) RN10.7
N$104: GPIO_C.7(GPIO_6) RN10.6
N$105: GPIO_C.8(GPIO_7) RN10.5
N$106: GPIO_C.9(GPIO_8) RN11.8
N$107: GPIO_C.10(GPIO_9) RN11.7
N$108: GPIO_C.13(GPIO_10) RN11.6
N$109: GPIO_C.14(GPIO_11) RN11.5
N$110: GPIO_C.15(GPIO_12) RN12.8
N$111: GPIO_C.16(GPIO_13) RN12.7
N$112: GPIO_C.17(GPIO_14) RN12.6
N$113: GPIO_C.18(GPIO_15) RN12.5
N$114: GPIO_C.19(GPIO_16) RN16.8
N$115: GPIO_C.20(GPIO_17) RN16.7
N$116: GPIO_C.21(GPIO_18) RN16.6
N$117: GPIO_C.22(GPIO_19) RN16.5
N$118: GPIO_C.23(GPIO_20) RN17.8
N$119: GPIO_C.24(GPIO_21) RN17.7
N$120: GPIO_C.25(GPIO_22) RN17.6
N$121: GPIO_C.26(GPIO_23) RN17.5
N$122: GPIO_C.27(GPIO_24) RN18.8
N$123: GPIO_C.28(GPIO_25) RN18.7
N$124: GPIO_C.31(GPIO_26) RN18.6
N$125: GPIO_C.32(GPIO_27) RN18.5
N$126: GPIO_C.33(GPIO_28) RN19.8
N$127: GPIO_C.34(GPIO_29) RN19.7
N$128: GPIO_C.35(GPIO_30) RN19.6
N$129: GPIO_C.36(GPIO_31) RN19.5
N$130: GPIO_C.37(GPIO_32) RN15.8
N$131: GPIO_C.38(GPIO_33) RN15.7
N$132: GPIO_C.39(GPIO_34) RN15.6
N$133: GPIO_C.40(GPIO_35) RN15.5

### Buses
GPIOA[0..35]
GPIOB[0..35]
GPIOC[0..35]

### Notes on the sheet
- Resistors!!

## Sheet 6 of 12: Memory
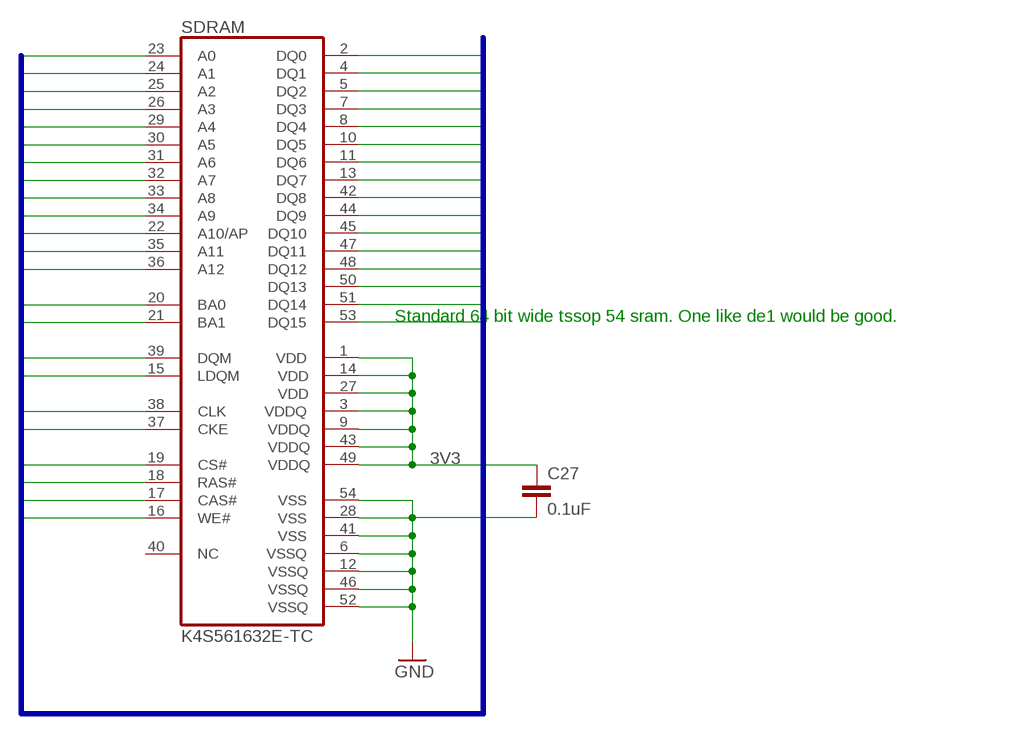
[diagram p5: schematic, sheet 6]

### Parts
C27  0.1uF  C-EUC0805  [C0805]
SDRAM  K4S561632E-TC  [TSOP54]

### Nets
3V3: C27.1 SDRAM.1(VDD) SDRAM.3(VDDQ) SDRAM.9(VDDQ) SDRAM.14(VDD) SDRAM.27(VDD) SDRAM.43(VDDQ) SDRAM.49(VDDQ) ; also sheet 1,2,3,5,8,9,10,11
A0: SDRAM.23(A0) ; also sheet 1
A1: SDRAM.24(A1) ; also sheet 1
A2: SDRAM.25(A2) ; also sheet 1
A3: SDRAM.26(A3) ; also sheet 1
A4: SDRAM.29(A4) ; also sheet 1
A5: SDRAM.30(A5) ; also sheet 1
A6: SDRAM.31(A6) ; also sheet 1
A7: SDRAM.32(A7) ; also sheet 1
A8: SDRAM.33(A8) ; also sheet 1
A9: SDRAM.34(A9) ; also sheet 1
A10: SDRAM.22(A10/AP) ; also sheet 1
A11: SDRAM.35(A11) ; also sheet 1
A12: SDRAM.36(A12) ; also sheet 1
BA0: SDRAM.20(BA0) ; also sheet 1
BA1: SDRAM.21(BA1) ; also sheet 1
CAS_N: SDRAM.17(CAS#) ; also sheet 1
CKE: SDRAM.37(CKE) ; also sheet 1
CS_N: SDRAM.19(CS#) ; also sheet 1
DQ0: SDRAM.2(DQ0) ; also sheet 1
DQ1: SDRAM.4(DQ1) ; also sheet 1
DQ2: SDRAM.5(DQ2) ; also sheet 1
DQ3: SDRAM.7(DQ3) ; also sheet 1
DQ4: SDRAM.8(DQ4) ; also sheet 1
DQ5: SDRAM.10(DQ5) ; also sheet 1
DQ6: SDRAM.11(DQ6) ; also sheet 1
DQ7: SDRAM.13(DQ7) ; also sheet 1
DQ8: SDRAM.42(DQ8) ; also sheet 1
DQ9: SDRAM.44(DQ9) ; also sheet 1
DQ10: SDRAM.45(DQ10) ; also sheet 1
DQ11: SDRAM.47(DQ11) ; also sheet 1
DQ12: SDRAM.48(DQ12) ; also sheet 1
DQ13: SDRAM.50(DQ13) ; also sheet 1
DQ14: SDRAM.51(DQ14) ; also sheet 1
DQ15: SDRAM.53(DQ15) ; also sheet 1
GND: C27.2 SDRAM.6(VSSQ) SDRAM.12(VSSQ) SDRAM.28(VSS) SDRAM.41(VSS) SDRAM.46(VSSQ) SDRAM.52(VSSQ) SDRAM.54(VSS) ; also sheet 1,2,3,4,5,7,8,9,10,11,12
RAS_N: SDRAM.18(RAS#) ; also sheet 1
SDRAM_CLK: SDRAM.38(CLK) ; also sheet 1
SDRAM_LDQM: SDRAM.15(LDQM) ; also sheet 1
SDRAM_UDQM: SDRAM.39(DQM) ; also sheet 1
WE_N: SDRAM.16(WE#) ; also sheet 1
Unconnected: SDRAM.40(NC)

### Buses
SDRAM:A[0..12],DQ[0..15],CS_N,RAS_N,CAS_N,WE_N,SDRAM_CLK,CKE,SDRAM_UDQM,SDRAM_LDQM,BA[0..1]

### Notes on the sheet
- Standard 64 bit wide tssop 54 sram. One like de1 would be good.

## Sheet 7 of 12: Controllers
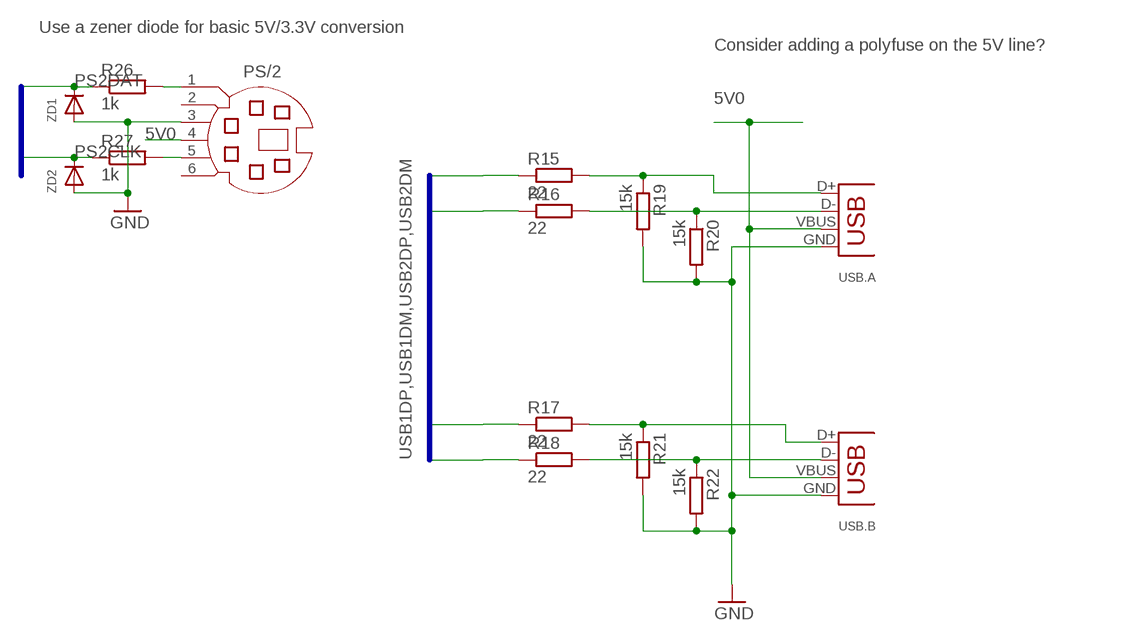
[diagram p6: schematic, sheet 7]

### Parts
PS/2  MD06SS  [MDIN06SS]
R15  22  R-EU_R0805  [R0805]
R16  22  R-EU_R0805  [R0805]
R17  22  R-EU_R0805  [R0805]
R18  22  R-EU_R0805  [R0805]
R19  15k  R-EU_R0805  [R0805]
R20  15k  R-EU_R0805  [R0805]
R21  15k  R-EU_R0805  [R0805]
R22  15k  R-EU_R0805  [R0805]
R26  1k  R-EU_R0805  [R0805]
R27  1k  R-EU_R0805  [R0805]
USB.A  USB-A-H  [USB-A-H]
USB.B  USB-A-H  [USB-A-H]
ZD1  DIODESOT23_REFLOW  [SOT23-R]
ZD2  DIODESOT23_REFLOW  [SOT23-R]

### Nets
5V0: PS/2.4 USB.A.VBUS USB.B.VBUS ; also sheet 3,5,9,11
GND: PS/2.3 R19.2 R20.2 R21.2 R22.2 USB.A.GND USB.B.GND ZD1.1(A) ZD2.1(A) ; also sheet 1,2,3,4,5,6,8,9,10,11,12
N$19: PS/2.5 R27.2
N$20: R15.2 R19.1 USB.A.D+
N$21: PS/2.1 R26.2
N$23: R16.2 R20.1 USB.A.D-
N$25: R17.2 R21.1 USB.B.D+
N$26: R18.2 R22.1 USB.B.D-
PS2CLK: R27.1 ZD2.3(C) ; also sheet 1
PS2DAT: R26.1 ZD1.3(C) ; also sheet 1
USB1DM: R16.1 ; also sheet 1
USB1DP: R15.1 ; also sheet 1
USB2DM: R18.1 ; also sheet 1
USB2DP: R17.1 ; also sheet 1
Unconnected: PS/2.2 PS/2.6

### Buses
USB1DP,USB1DM,USB2DP,USB2DM
PS2DAT,PS2CLK

### Notes on the sheet
- Use a zener diode for basic 5V/3.3V conversion
- Consider adding a polyfuse on the 5V line?

## Sheet 8 of 12: DAC decoupling
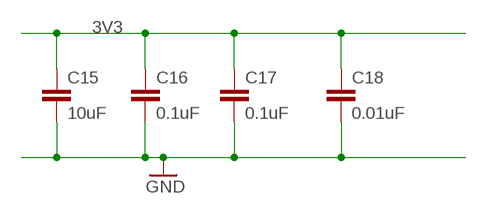
[diagram p7: schematic, sheet 8]

### Parts
C15  10uF  C-EUC0805  [C0805]
C16  0.1uF  C-EUC0805  [C0805]
C17  0.1uF  C-EUC0805  [C0805]
C18  0.01uF  C-EUC0805  [C0805]

### Nets
3V3: C15.1 C16.1 C17.1 C18.1 ; also sheet 1,2,3,5,6,9,10,11
GND: C15.2 C16.2 C17.2 C18.2 ; also sheet 1,2,3,4,5,6,7,9,10,11,12

## Sheet 9 of 12: Voltage regulation
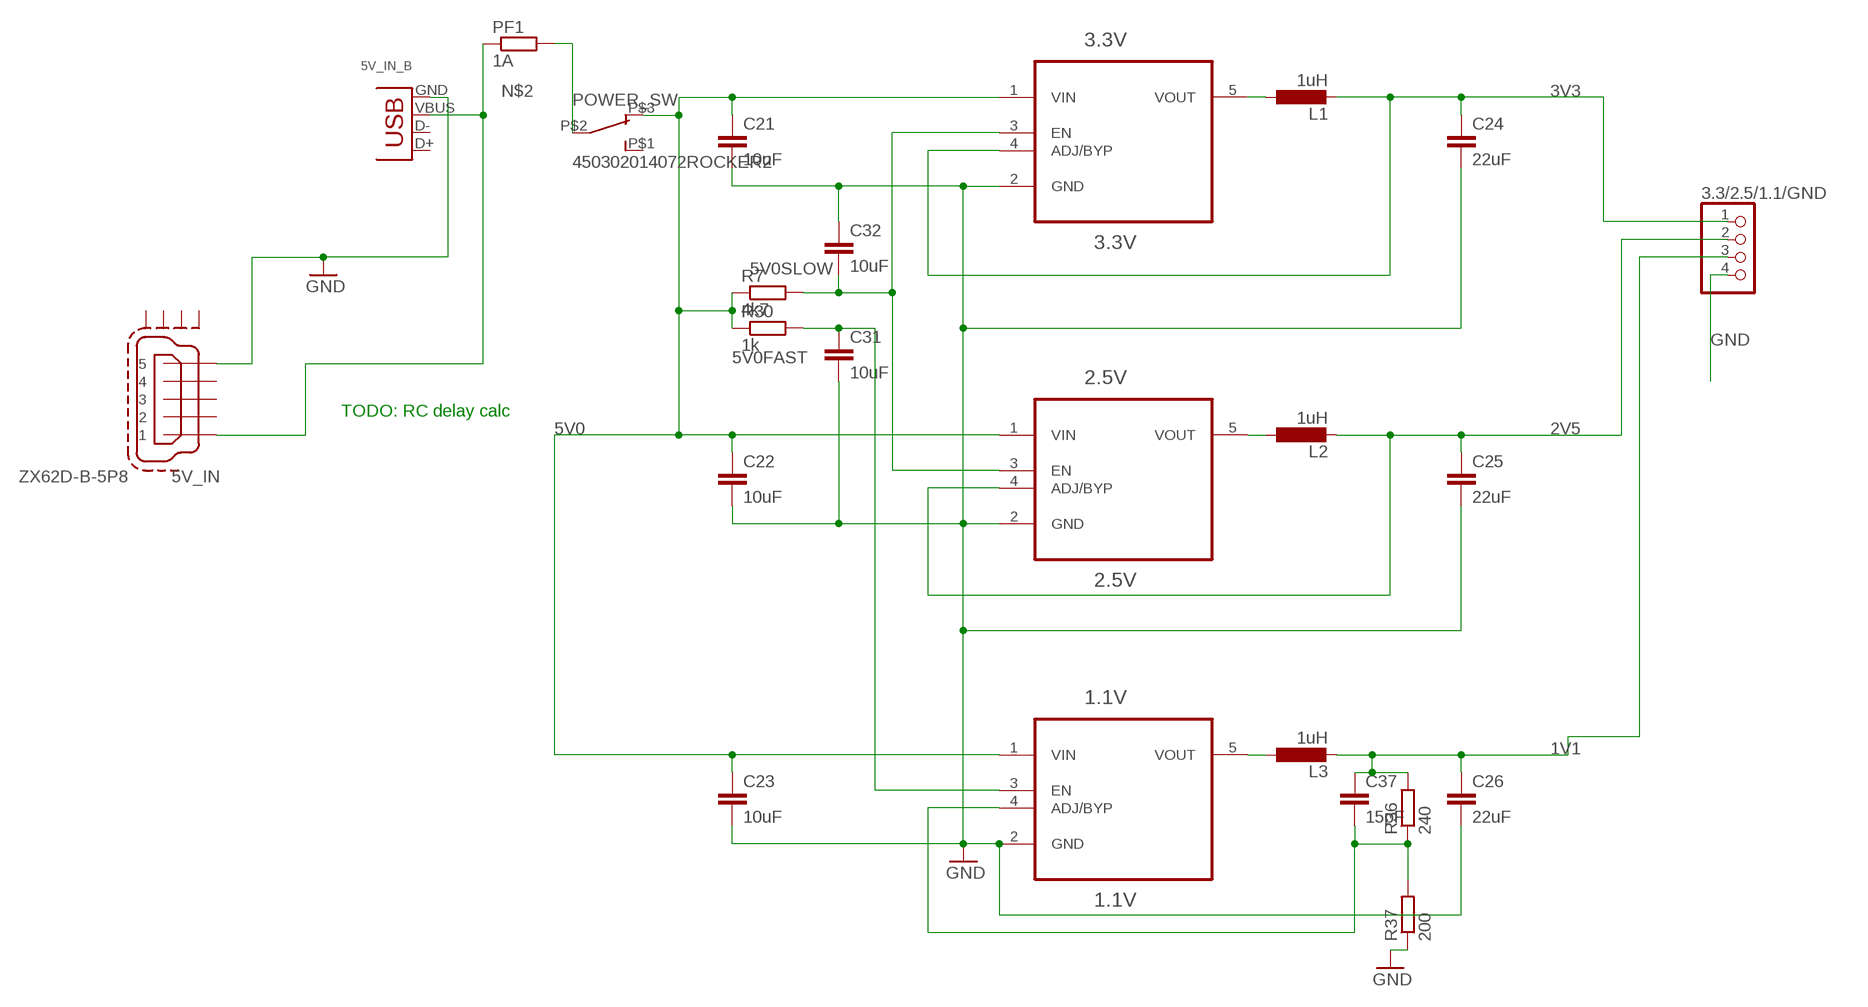
[diagram p8: schematic, sheet 9]

### Parts
1.1V  1.1V  SPX3819M5-L-5-0  [SOT95P280X145-5N]
2.5V  2.5V  SPX3819M5-L-5-0  [SOT95P280X145-5N]
3.3/2.5/1.1/GND  PINHD-1X4  [1X04]
3.3V  3.3V  SPX3819M5-L-5-0  [SOT95P280X145-5N]
5V_IN  ZX62D-B-5P8  [ZX62D-B-5P8]
5V_IN_B  USB-B-H  [USB-B-H]
C21  10uF  C-EUC0805  [C0805]
C22  10uF  C-EUC0805  [C0805]
C23  10uF  C-EUC0805  [C0805]
C24  22uF  C-EUC0805  [C0805]
C25  22uF  C-EUC0805  [C0805]
C26  22uF  C-EUC0805  [C0805]
C31  10uF  C-EUC0805  [C0805]
C32  10uF  C-EUC0805  [C0805]
C37  15pF  C-EUC0805  [C0805]
L1  1uH  L-EUL3225M  [L3225M]
L2  1uH  L-EUL3225M  [L3225M]
L3  1uH  L-EUL3225M  [L3225M]
PF1  1A  R-EU_R1206  [R1206]
POWER_SW  450302014072ROCKER2  [ROCKER_VERT_SPDT2]
R7  4k7  R-EU_R0805  [R0805]
R30  1k  R-EU_R0805  [R0805]
R36  240  R-EU_R0805  [R0805]
R37  200  R-EU_R0805  [R0805]

### Nets
1V1: 3.3/2.5/1.1/GND.3 C26.1 C37.1 L3.2 R36.2 ; also sheet 1,2
2V5: 2.5V.4(ADJ/BYP) 3.3/2.5/1.1/GND.2 C25.1 L2.2 ; also sheet 1,2
3V3: 3.3/2.5/1.1/GND.1 3.3V.4(ADJ/BYP) C24.1 L1.2 ; also sheet 1,2,3,5,6,8,10,11
5V0: 1.1V.1(VIN) 2.5V.1(VIN) 3.3V.1(VIN) C21.1 C22.1 C23.1 POWER_SW.P$3 R7.1 R30.1 ; also sheet 3,5,7,11
5V0FAST: 1.1V.3(EN) C31.1 R30.2
5V0SLOW: 2.5V.3(EN) 3.3V.3(EN) C32.2 R7.2
GND: 1.1V.2(GND) 2.5V.2(GND) 3.3/2.5/1.1/GND.4 3.3V.2(GND) 5V_IN.P$5 5V_IN_B.GND C21.2 C22.2 C23.2 C24.2 C25.2 C26.2 C31.2 C32.1 R37.1 ; also sheet 1,2,3,4,5,6,7,8,10,11,12
N$2: 5V_IN.P$1 5V_IN_B.VBUS PF1.1
N$135: 1.1V.5(VOUT) L3.1
N$136: 2.5V.5(VOUT) L2.1
N$137: 3.3V.5(VOUT) L1.1
N$139: PF1.2 POWER_SW.P$2
N$145: 1.1V.4(ADJ/BYP) C37.2 R36.1 R37.2
Unconnected: 5V_IN.P$2 5V_IN.P$3 5V_IN.P$4 5V_IN.SH1 5V_IN.SH2 5V_IN.SH3 5V_IN.SH4 5V_IN_B.D+ 5V_IN_B.D- POWER_SW.P$1

### Notes on the sheet
- TODO: RC delay calc

## Sheet 10 of 12: SD card
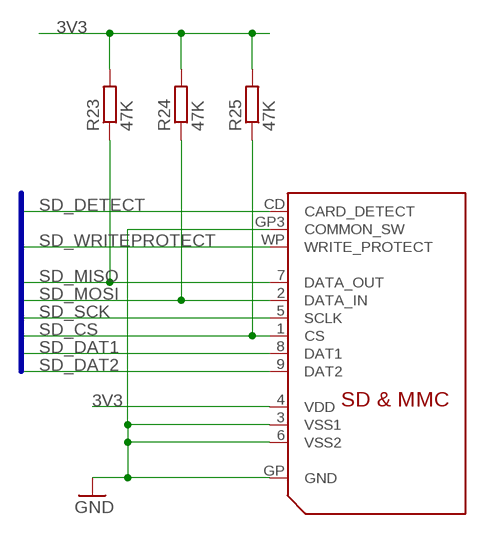
[diagram p9: schematic, sheet 10]

### Parts
R23  47K  R-EU_M0805  [M0805]
R24  47K  R-EU_M0805  [M0805]
R25  47K  R-EU_M0805  [M0805]
U$2  SDMMCHALFHEIGHT  [HALFHEIGHTSD]

### Nets
3V3: R23.2 R24.2 R25.2 U$2.4(VDD) ; also sheet 1,2,3,5,6,8,9,11
GND: U$2.3(VSS1) U$2.6(VSS2) U$2.GP3(COMMON_SW) U$2.GP(GND) ; also sheet 1,2,3,4,5,6,7,8,9,11,12
SD_CS: R25.1 U$2.1(CS) ; also sheet 1
SD_DAT1: U$2.8(DAT1) ; also sheet 1
SD_DAT2: U$2.9(DAT2) ; also sheet 1
SD_DETECT: U$2.CD(CARD_DETECT) ; also sheet 1
SD_MISO: R23.1 U$2.7(DATA_OUT) ; also sheet 1
SD_MOSI: R24.1 U$2.2(DATA_IN) ; also sheet 1
SD_SCK: U$2.5(SCLK) ; also sheet 1
SD_WRITEPROTECT: U$2.WP(WRITE_PROTECT) ; also sheet 1

### Buses
SD_DETECT,SD_WRITEPROTECT,SD_CS,SD_MISO,SD_MOSI,SD_SCK,SD_DAT1,SD_DAT2

## Sheet 11 of 12: ADC
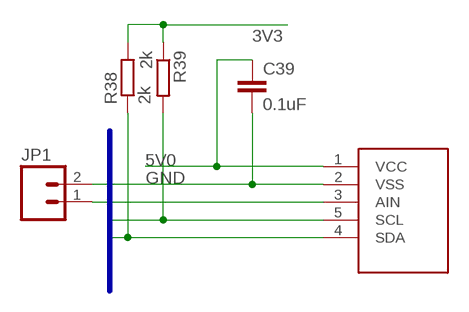
[diagram p10: schematic, sheet 11]

### Parts
ADC  MCP3021  [SOT95P280X145-5N]
C39  0.1uF  C-EUC0805  [C0805]
JP1  M02PTH  [1X02]
R38  2k  R-EU_M0805  [M0805]
R39  2k  R-EU_M0805  [M0805]

### Nets
3V3: R38.2 R39.1 ; also sheet 1,2,3,5,6,8,9,10
5V0: ADC.1(VCC) C39.1 ; also sheet 3,5,7,9
AUDIO_IN: ADC.3(AIN) JP1.1
GND: ADC.2(VSS) C39.2 JP1.2 ; also sheet 1,2,3,4,5,6,7,8,9,10,12
SCL: ADC.5(SCL) R39.2 ; also sheet 1
SDA: ADC.4(SDA) R38.1 ; also sheet 1

### Buses
ADC:SCL,SDA

## Sheet 12 of 12: Mounting
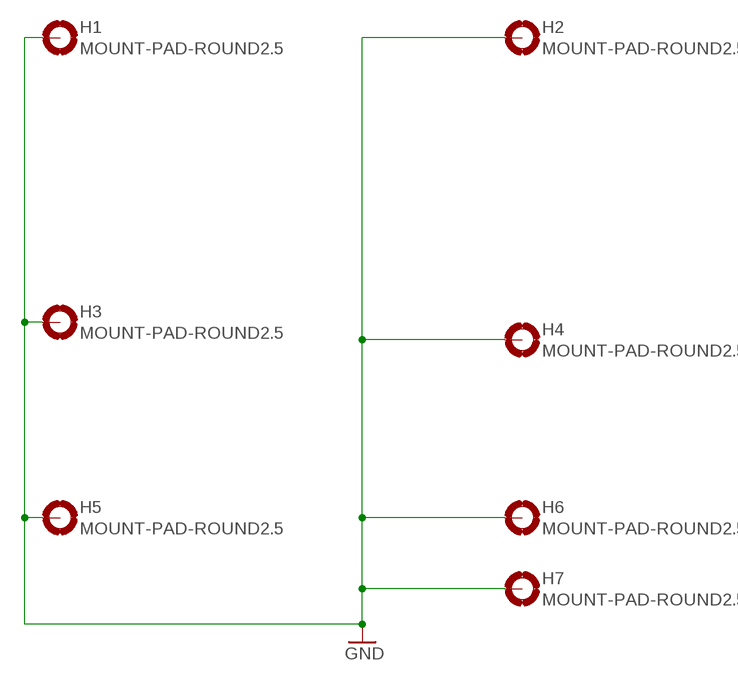
[diagram p11: schematic, sheet 12]

### Parts
H1  MOUNT-PAD-ROUND2.5  [2,5-PAD]
H2  MOUNT-PAD-ROUND2.5  [2,5-PAD]
H3  MOUNT-PAD-ROUND2.5  [2,5-PAD]
H4  MOUNT-PAD-ROUND2.5  [2,5-PAD]
H5  MOUNT-PAD-ROUND2.5  [2,5-PAD]
H6  MOUNT-PAD-ROUND2.5  [2,5-PAD]
H7  MOUNT-PAD-ROUND2.5  [2,5-PAD]

### Nets
GND: H1.B2,8(MOUNT) H2.B2,8(MOUNT) H3.B2,8(MOUNT) H4.B2,8(MOUNT) H5.B2,8(MOUNT) H6.B2,8(MOUNT) H7.B2,8(MOUNT) ; also sheet 1,2,3,4,5,6,7,8,9,10,11

## Library data of the parts
1.1V 2.5V 3.3V = Exar_By_element14_Batch_1:SPX3819M5-L-5-0: 500mA, LOW-NOISE LDO VOLTAGE REGULATOR; MPN: SPX3819M5-L-5-0; OC_FARNELL: 1829408; OC_NEWARK: 84R4417; PACKAGE: SOT-23-5; SUPPLIER: EXAR
3.3/2.5/1.1/GND = pinhead:PINHD-1X4: PIN HEADER
5V_IN = j_usb_hirose_zx62d-b-5p8:ZX62D-B-5P8: Hirose ZX62D-B-5P8 Micro-B USB connector, standard mount location, with through-hold shell tabs and SMD pins.
5V_IN_B USB.A USB.B = con-usb-3:USB: USB Connectors
ADC = adc:MCP3021
AUDIO = LIBstereoaudiojack:AUDIO-JACK2: Stereo audio jack with bypass switches. SMT version used on LilyPad MP3 board.
C1-C39 = rcl:C-EU: CAPACITOR, European symbol
C-VIDEO = con-hirschmann:TOBU3: Female Cinch CONNECTOR ( RCA Jack )
GPIO_A GPIO_B GPIO_C = de1_parts:DE1_GPIO
H1-H7 = holes:MOUNT-PAD-ROUND: MOUNTING PAD, round
HDMI = raspberrypi_cm:HDMI
JP1 = SparkFun-Connectors:M02: Standard 2-pin 0.1" header. Use with - straight break away headers ( PRT-00116) - right angle break away headers (PRT-00553) - swiss pins (PRT-00743) - machine pins (PRT-00117) - female headers (PRT-00115) Molex polarized connector foot print use with: PRT-08233 with associated crimp pins and housings. 2.54_SCREWTERM for use with PRT-10571. 3.5mm Screw Terminal footprints for PRT-08084 5mm Screw Terminal footprints for use with PRT-08432
JTAG = con-headers-jp:M-2X05-: MALE HEADER
L1-L3 = rcl:L-EU: INDUCTOR, European symbol
PF1 R1-R39 = rcl:R-EU_: RESISTOR, European symbol
POWER_SW = Eagle_Wuerth_Elektronik_Switch_rev15b:450302014072: WS-SUT, 10mm*2.5mm, SPDT, ON-ON, 2.54mm, right angle type, THT, Mini Slide Switch, 3 pins
PS/2 = con-yamaichi:MD06SS: YAMAICHI CONNECTOR; OC_FARNELL: unknown; OC_NEWARK: unknown
RESET = Seeed-OPL-Switch:SMD-BUTTON(4P-4.0X4.0X1.7MM): 311020027
RN1-RN29 = resistor-array:742-8: CTS 742 Series 8 Terminations, 4 Resistors
S-VIDEO = con-yamaichi:MD04SS: YAMAICHI CONNECTOR; OC_FARNELL: unknown; OC_NEWARK: unknown
SDRAM = sdram:K4S561632E-TC: SDRAM 4M x 16bit x 4 banks synchronous DRAM. 256 Mbit SDRAM.
SPI = epcs:EPCS: SPI Serial EEPROM; MPN: AT25320B-SSHL-B; OC_FARNELL: 1841578; OC_NEWARK: 12T1359; PACKAGE: SOIC-8; SUPPLIER: Atmel
U$1 = cyclonev_f484:CYCLONEVFPGA484
U$2 = adafruit:SDMMC: SD MMC Card holder 4UCON part #06132 - easy to solder
U$3-U$5 = header127:HDR_SMALL_36_DEV_L
VGA = SparkFun-Connectors:DB15: DB15 / VGA right angle through-hole female connector.
VIDEODACSA = Analog Devices_By_element14_Batch_1:ADV7125BCPZ170: 8-Bit High Speed Video DAC
XTL = crystal:CRYSTAL_RES-: CRYSTAL RESONATOR
ZD1 ZD2 = adafruit:DIODE: Diode SMADIODE - SMA Surface Mount Package 20V 1A Schottky Diode Digikey: 641-1014-6-ND DO-1N4148 - Through Hole Small Current Diode SOD-123 20V 1 A (.5mV Vf) Schottky Diode - Digikey: MBRX120TPMSCT-ND SOD-323 10V 570mA (.38mV Vf, 3ns) Schottky Diode - Digikey: ZLLS410CT-ND SOD-523 30V 30mA Schottky Diode (RB751S-40TE61) - Digikey: RB751S-40TE61CT-ND SOT23-R/W - SOT23 Package (R = Solder Paste/Reflow Ovens, W = Hand-Soldering) BAT54Film 40V 300mA - Digikey: 497-7162-1-ND